# Altium schematic sheet OV2640.SchDoc
size A4
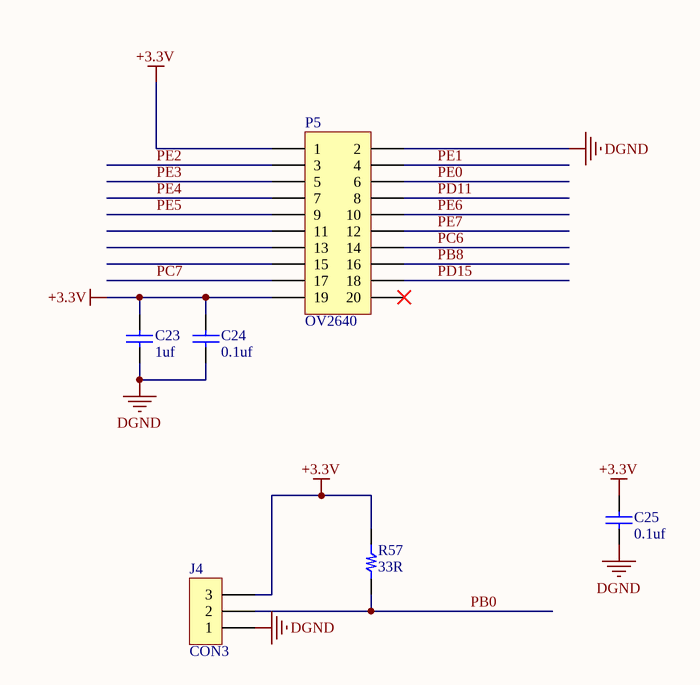
[diagram p0: OV2640.SchDoc]

## Parts
C23  1uf  [0805C]
C24  0.1uf  [0805C]
C25  0.1uf  [0805C]
J4  CON3  [HDR1X3-2.54MM]
P5  OV2640  [HDR2X10-2.54MM]
R57  33R  [0805_small]

## Nets
+3.3V: C23.1 C24.1 C25.1 J4.3 P5.1 P5.19 R57.1
DGND: C23.2 C24.2 C25.2 J4.1 P5.2
PB0: J4.2 R57.2
PB8: P5.16
PC6: P5.14
PC7: P5.17
PD11: P5.8
PD15: P5.18
PE0: P5.6
PE1: P5.4
PE2: P5.3
PE3: P5.5
PE4: P5.7
PE5: P5.9
PE6: P5.10
PE7: P5.12

Not connected (* = marked no-connect by the designer): P5 11 13 15 20*

## Library data of the parts
C23-C25 = Cap: 贴片电容; Value: 100pF; Published: 8-Jun-2000; LatestRevisionDate: 17-Jul-2002; LatestRevisionNote: Re-released for DXP Platform.; PackageReference: RAD-0.3; Publisher: Altium Limited
J4 = CON3: Connector
P5 = CON10X2: Header, 10-Pin, Dual row; LatestRevisionDate: 17-Jul-2002; LatestRevisionNote: Re-released for DXP Platform.; Publisher: Altium Limited
R57 = Res: 电阻; Value: 230k; Published: 24-Mar-1999; LatestRevisionDate: 29-May-2009; LatestRevisionNote: IPC-7351 Footprint Added.; PackageVersion: Mar-2003; PackageReference: 6-0805; Publisher: Altium Limited; PackageDescription: Chip Resistor 0805 Case Size; Code_IPC: RESC2012